# Altium project pca63100.PrjPCB (part 3 of 3)

## Sheet pca63100_mcu.SchDoc: Power Profiler Kit II
size A3; Organization: Nordic Semiconductor; DocumentNumber: 0; Revision: 1.0.1; SheetNumber: 2; SheetTotal: 6; Author: HANY; CompanyName: Nordic Semiconductor; DrawnBy: HANY; DocumentSize: A3; ProjectName: Power Profiler Kit II
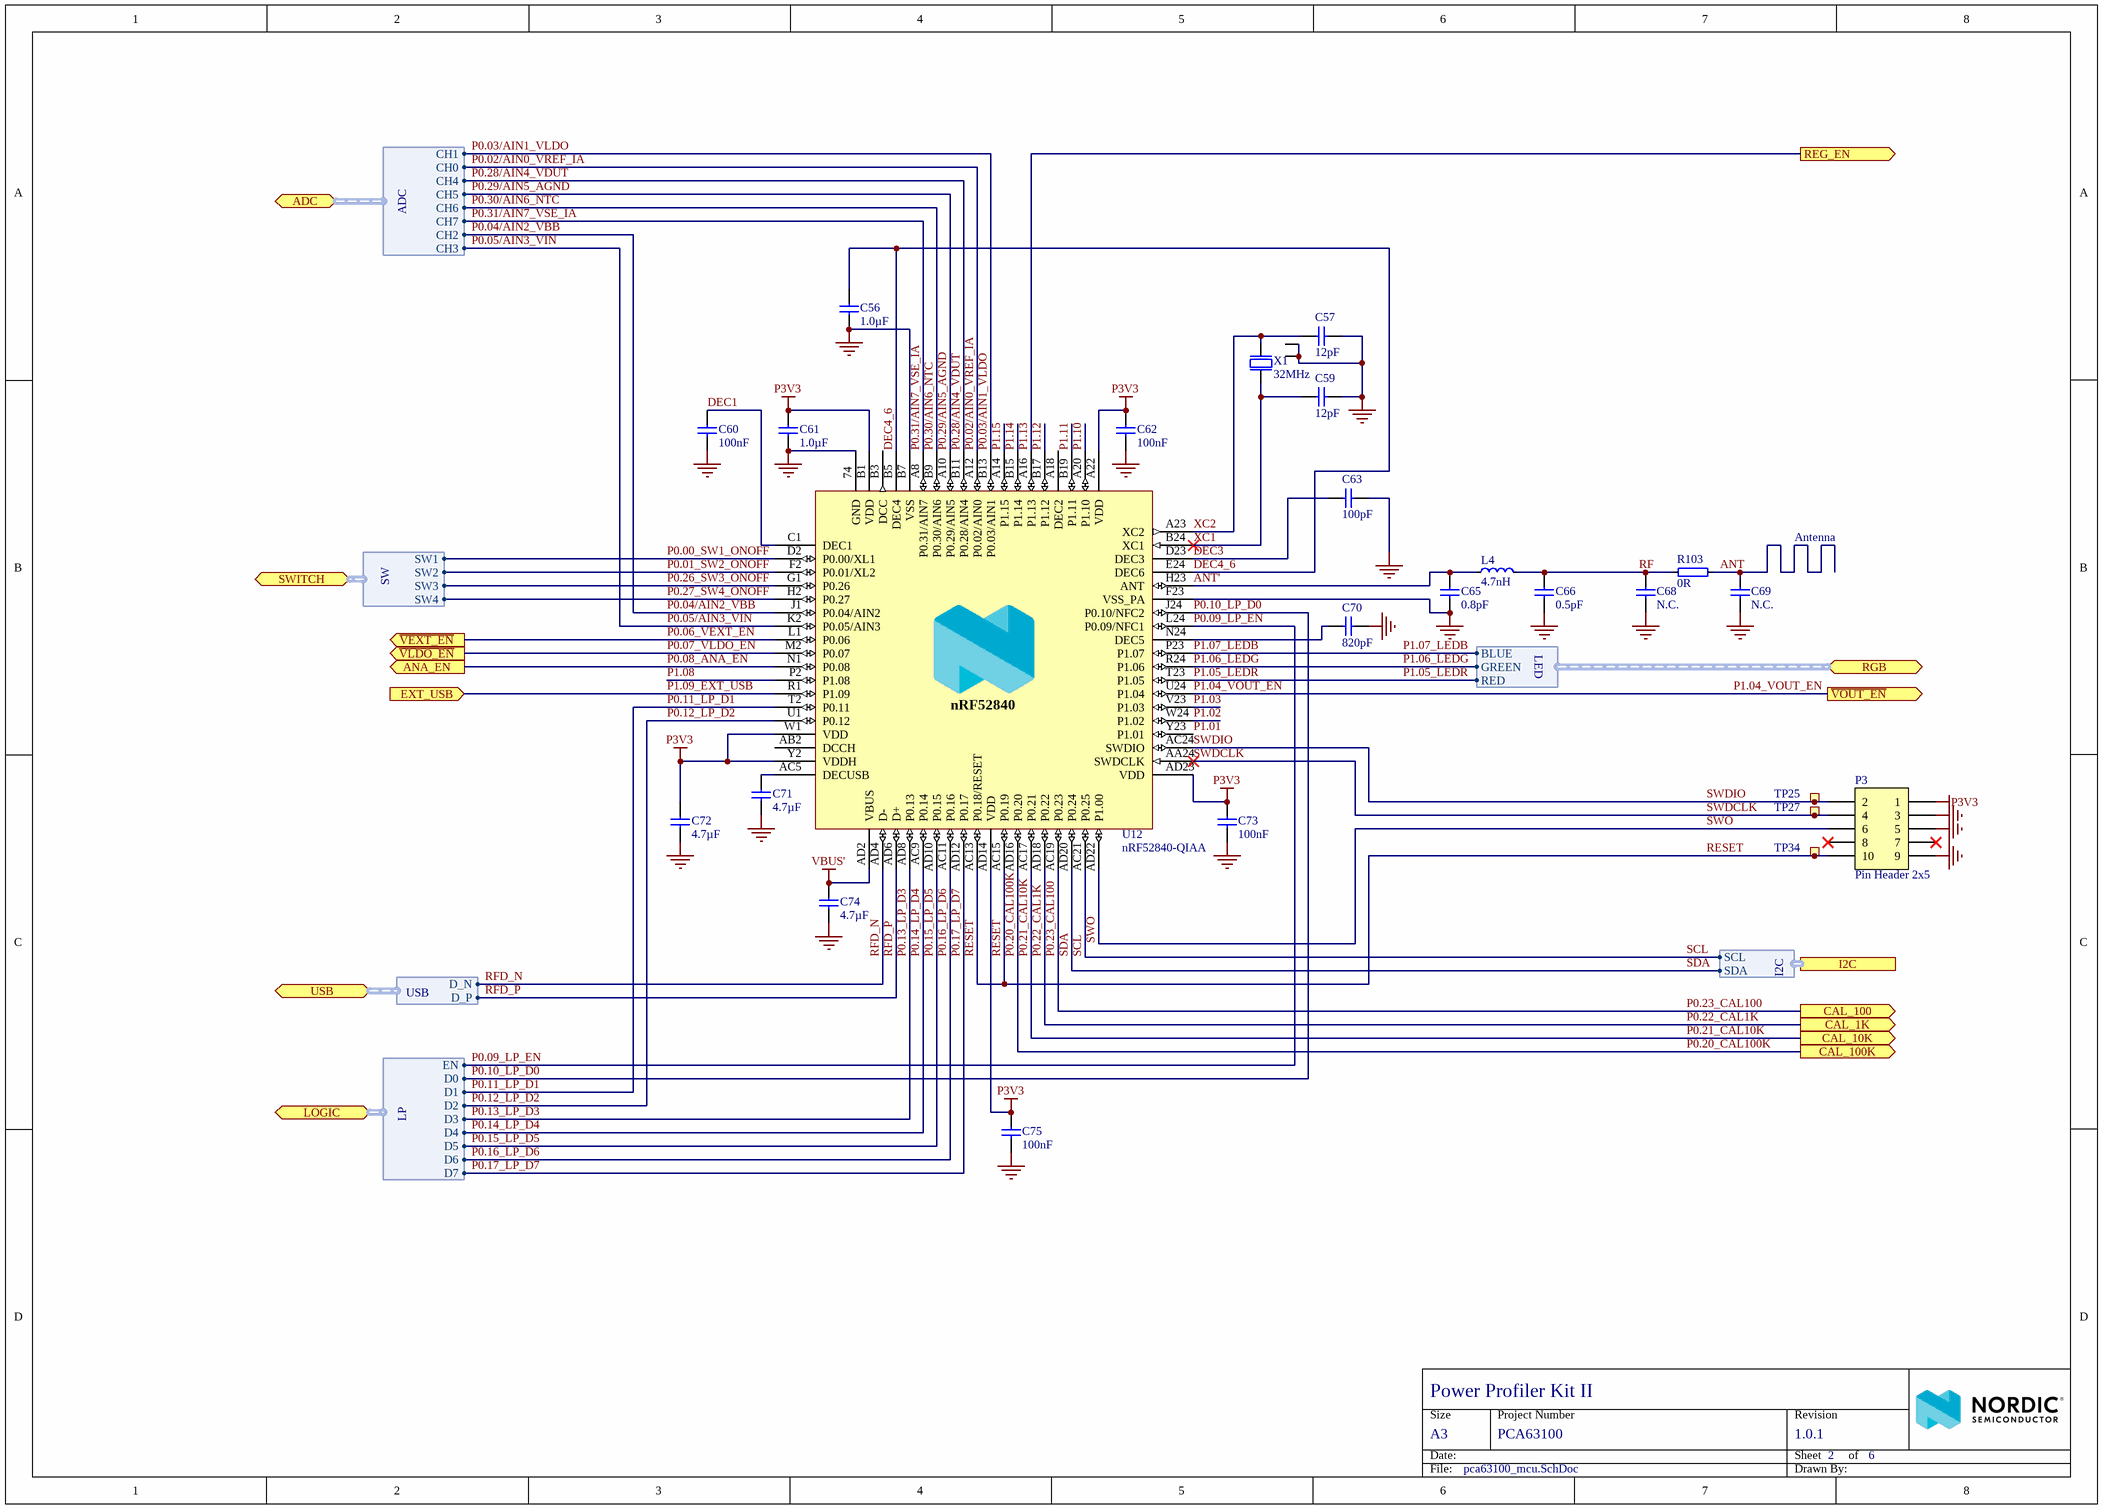
[diagram p5: pca63100_mcu.SchDoc]

### Parts
C56  1.0µF  [CAPC1005X04L]
C57  12pF  [CAPC1005X04L]
C59  12pF  [CAPC1005X04L]
C60  100nF  [CAPC0603X03L_C]
C61  1.0µF  [CAPC1005X04L]
C62  100nF  [CAPC0603X03L_C]
C63  100pF  [CAPC0603X03L_C]
C65  0.8pF  [CAPC1005X04L]
C66  0.5pF  [CAPC1005X04L]
C68  N.C.  [CAPC1005X04L_NC]
C69  N.C.  [CAPC1005X04L_NC]
C70  820pF  [CAPC1005X04L]
C71  4.7µF  [CAPC1005X04L]
C72  4.7µF  [CAPC1005X04L]
C73  100nF  [CAPC0603X03L_C]
C74  4.7µF  [CAPC1005X04L]
C75  100nF  [CAPC0603X03L_C]
L4  4.7nH  [INDC1005X04L]
P3  Pin Header 2x5  [HDR_2x5-SMD-1.27mm-ANG]
R103  0R  [RESC1005X04L]
TP25  Ø1.5mm,SMD  [TP_SMD_Ø1.5mm]  (value not drawn)  (no BOM)
TP27  Ø1.5mm,SMD  [TP_SMD_Ø1.5mm]  (value not drawn)  (no BOM)
TP34  Ø1.5mm,SMD  [TP_SMD_Ø1.5mm]  (value not drawn)  (no BOM)
U12  nRF52840-QIAA  [AQFN50P700X700X85_HS-74N]
X1  32MHz  [BT-XTAL_2016]

### Ports
ADC (bidir, harness ADC), ANA_EN (out), CAL_1K (out), CAL_10K (out), CAL_100 (out), CAL_100K (out), EXT_USB (in), I2C (harness I2C), LOGIC (bidir, harness LP), REG_EN (out), RGB (bidir, harness LED), SWITCH (bidir, harness SW), USB (bidir, harness USB), ~{VEXT_EN} (out), ~{VLDO_EN} (out), ~{VOUT_EN} (out)

### Harnesses
LP: D0, EN, D1, D2, D3, D4, D5, D6, D7
USB: D_N, D_P
LED: BLUE, GREEN, RED
SW: SW1, SW2, SW3, SW4
I2C: SCL, SDA
ADC: CH0, CH1, CH2, CH3, CH4, CH5, CH6, CH7

### Nets
GND: C56.1 C57.2 C59.2 C60.2 C61.2 C62.2 C63.2 C65.1 C66.1 C68.1 C69.1 C70.2 C71.2 C72.2 C73.2 C74.2 C75.2 P3.3 P3.5 P3.9 U12.74(GND) U12.B7(VSS) U12.F23(VSS_PA) X1.2(GND) X1.4(GND)
P3V3: C61.1 C62.1 C72.1 C73.1 C75.1 P3.1 U12.A22(VDD) U12.AD14(VDD) U12.AD23(VDD) U12.B1(VDD) U12.W1(VDD) U12.Y2(VDDH)
VBUS': C74.1 U12.AD2(VBUS)
ANT: C69.2 R103.2
ANT': C65.2 L4.1 U12.H23(ANT)
DEC1: C60.1 U12.C1(DEC1)
DEC3: C63.1 U12.D23(DEC3)
DEC4_6: C56.2 U12.B5(DEC4) U12.E24(DEC6)
P0.00_SW1_ONOFF: U12.D2(P0.00/XL1) ; port SWITCH.SW1
P0.01_SW2_ONOFF: U12.F2(P0.01/XL2) ; port SWITCH.SW2
P0.02/AIN0_VREF_IA: U12.A12(P0.02/AIN0) ; port ADC.CH0
P0.03/AIN1_VLDO: U12.B13(P0.03/AIN1) ; port ADC.CH1
P0.04/AIN2_VBB: U12.J1(P0.04/AIN2) ; port ADC.CH2
P0.05/AIN3_VIN: U12.K2(P0.05/AIN3) ; port ADC.CH3
P0.06_VEXT_EN: U12.L1(P0.06) ; port ~{VEXT_EN}
P0.07_VLDO_EN: U12.M2(P0.07) ; port ~{VLDO_EN}
P0.08_ANA_EN: U12.N1(P0.08) ; port ANA_EN
P0.09_LP_EN: U12.L24(P0.09/NFC1) ; port LOGIC.EN
P0.10_LP_D0: U12.J24(P0.10/NFC2) ; port LOGIC.D0
P0.11_LP_D1: U12.T2(P0.11) ; port LOGIC.D1
P0.12_LP_D2: U12.U1(P0.12) ; port LOGIC.D2
P0.13_LP_D3: U12.AD8(P0.13) ; port LOGIC.D3
P0.14_LP_D4: U12.AC9(P0.14) ; port LOGIC.D4
P0.15_LP_D5: U12.AD10(P0.15) ; port LOGIC.D5
P0.16_LP_D6: U12.AC11(P0.16) ; port LOGIC.D6
P0.17_LP_D7: U12.AD12(P0.17) ; port LOGIC.D7
P0.20_CAL100K: U12.AD16(P0.20) ; port CAL_100K
P0.21_CAL10K: U12.AC17(P0.21) ; port CAL_10K
P0.22_CAL1K: U12.AD18(P0.22) ; port CAL_1K
P0.23_CAL100: U12.AC19(P0.23) ; port CAL_100
P0.26_SW3_ONOFF: U12.G1(P0.26) ; port SWITCH.SW3
P0.27_SW4_ONOFF: U12.H2(P0.27) ; port SWITCH.SW4
P0.28/AIN4_VDUT: U12.B11(P0.28/AIN4) ; port ADC.CH4
P0.29/AIN5_AGND: U12.A10(P0.29/AIN5) ; port ADC.CH5
P0.30/AIN6_NTC: U12.B9(P0.30/AIN6) ; port ADC.CH6
P0.31/AIN7_VSE_IA: U12.A8(P0.31/AIN7) ; port ADC.CH7
P1.01: U12.Y23(P1.01)
P1.02: U12.W24(P1.02)
P1.03: U12.V23(P1.03)
P1.04_VOUT_EN: U12.U24(P1.04) ; port ~{VOUT_EN}
P1.05_LEDR: U12.T23(P1.05) ; port RGB.RED
P1.06_LEDG: U12.R24(P1.06) ; port RGB.GREEN
P1.07_LEDB: U12.P23(P1.07) ; port RGB.BLUE
P1.08: U12.P2(P1.08)
P1.09_EXT_USB: U12.R1(P1.09) ; port EXT_USB
P1.10: U12.A20(P1.10)
P1.11: U12.B19(P1.11)
P1.12: U12.B17(P1.12)
P1.13: U12.A16(P1.13) ; port REG_EN
P1.14: U12.B15(P1.14)
P1.15: U12.A14(P1.15)
RESET: P3.10 TP34.1 U12.AC13(P0.18/RESET) U12.AC15(P0.19)
RF: C66.2 C68.2 L4.2 R103.1
RFD_N: U12.AD4(D-) ; port USB.D_N
RFD_P: U12.AD6(D+) ; port USB.D_P
SCL: U12.AC21(P0.25) ; port I2C.SCL
SDA: U12.AD20(P0.24) ; port I2C.SDA
SWDCLK: P3.4 TP27.1 U12.AA24(SWDCLK)
SWDIO: P3.2 TP25.1 U12.AC24(SWDIO)
SWO: P3.6 U12.AD22(P1.00)
XC1: C59.1 U12.B24(XC1) X1.1(inp)
XC2: C57.1 U12.A23(XC2) X1.3(out)
NetC70_1: C70.1 U12.N24(DEC5)
NetC71_1: C71.1 U12.AC5(DECUSB)

Not connected (* = marked no-connect by the designer): P3 7* 8*; U12 A18(DEC2) AB2(DCCH) B3(DCC)

### Notes on the sheet
- Antenna
- Size
- Date:
- A3
- Project Number
- Sheet         of
- Revision
- File:
- Drawn By:
- (in symbol nRF52840-QIAAD0) nRF52840

### Library data of the parts
C56 C61 = C0402-1µ0: Capacitor, X5R, ±5%, 6.3V; Part number IPS: 00000007786, 00000003457; Artikkelnr Noca: 20039235; Pad Count: 2; Part Number: C0402-1µ0; LatestRevisionDate: 2016-08-22; Pin Count: 2; Publisher: Nordic Semiconductor; Published: 2009-05-08; Value: 1.0µF; Note: 6.3V; Footprint Doc: 0402; ComponentLink1Description: Datasheet; ComponentLink2Description: Supplier link; Supplier 1: Digi-Key; Supplier Part Number 1: 1276-1444-1-ND; Component Class: Capacitors; PartId: 100200190
C57 C59 = C0402-12p: Capacitor, NP0, ±2%; Part number IPS: 00000002398; Note: 50V; Artikkelnr Noca: 20029159; Pad Count: 2; Part Number: C0402-12p; LatestRevisionDate: 2011-05-11; Pin Count: 2; Publisher: Nordic Semiconductor; Published: 2009-05-08; Value: 12pF; Footprint Doc: 0402; ComponentLink1Description: Datasheet; ComponentLink2Description: Supplier link; Component Class: Capacitors; PartId: 100200137
C60 C62 C73 C75 = C0201-100n: Capacitor, X5R, ±10%; Part number IPS: 00000001248, 00000002505; Note: 16V; Artikkelnr Noca: N.A.; Pad Count: 2; Part Number: C0201-100n; LatestRevisionDate: 2017-11-09; Pin Count: 2; Publisher: Nordic Semiconductor; Published: 2014-11-13; Value: 100nF; Footprint Doc: 0201; ComponentLink1Description: Datasheet; ComponentLink2Description: Supplier link; Component Class: Capacitors; PartId: 100200078
C63 = C0201-100p: Capacitor, NP0, ±2%, 25V; Manufacturer: Murata; Manufacturer Part Number: GRM0335C1E101GA01; Part number IPS: 00000007853; Artikkelnr Noca: N.A.; Pad Count: 2; Part Number: C0201-100p; LatestRevisionDate: 2019-04-16; Pin Count: 2; Publisher: Nordic Semiconductor; Published: 2019-04-16; Value: 100pF; Note: 25V; Footprint Doc: 0201; ComponentLink1Description: Datasheet; ComponentLink2Description: Supplier link; Component Class: Capacitors; PartId: 100200044
C65 = C0402-0.8p: Capacitor, NP0, ±5%; Manufacturer: Murata; Manufacturer Part Number: GRM1555C1HR80WA01D; Part number IPS: 00000007782; Note: 50V; Artikkelnr Noca: 20029147; Pad Count: 2; Part Number: C0402-0.8p; LatestRevisionDate: 2012-11-21; Pin Count: 2; Publisher: Nordic Semiconductor; Published: 2009-05-08; Value: 0.8pF; Footprint Doc: 0402; ComponentLink1Description: Datasheet; ComponentLink1URL: https://www.murata.com/~/media/webrenewal/support/library/catalog/products/capacitor/mlcc/c02e.ashx?la=en-us; ComponentLink2Description: Supplier link; Supplier 1: Digi-Key; Supplier Part Number 1: 490-6270-1-ND; Component Class: Capacitors; PartId: 100200116
C66 = C0402-0.5p: Capacitor, NP0, ±0.05pF; Manufacturer: Murata; Manufacturer Part Number: GJM1555C1HR50WB01; Part number IPS: 00000004293; Note: 50V; Artikkelnr Noca: 20020007; Pad Count: 2; Part Number: C0402-0.5p; LatestRevisionDate: 2020-10-13; Pin Count: 2; Publisher: Nordic Semiconductor; Published: 2009-05-08; Value: 0.5pF; Footprint Doc: 0402; ComponentLink1Description: Datasheet; ComponentLink2Description: Supplier link; Supplier 1: Digi-Key; Supplier Part Number 1: 490-11250-1-ND; Component Class: Capacitors; PartId: 100200112
C68 C69 = C0402-N.C.: Not mounted; Note: Chip Cap; Artikkelnr Noca: N.A.; Assembly: Not mounted; Pad Count: 2; Part Number: C0402-N.C.; Footprint Doc: 0402; LatestRevisionDate: 2009-05-08; Pin Count: 2; Publisher: Nordic Semiconductor; Published: 2009-05-08; Value: N.C.; ComponentLink1Description: Datasheet; ComponentLink2Description: Supplier link; Part number IPS: N.A.; Component Class: Capacitors; PartId: 100200105
C70 = C0402-820p: Capacitor, NP0, ±5%; Part number IPS: 00000004365; Note: 50V; Artikkelnr Noca: 20029219; Pad Count: 2; Part Number: C0402-820p; LatestRevisionDate: 2020-10-13; Pin Count: 2; Publisher: Nordic Semiconductor; Published: 2009-05-08; Value: 820pF; Footprint Doc: 0402; ComponentLink1Description: Datasheet; ComponentLink2Description: Supplier link; Component Class: Capacitors; PartId: 100200161
C71 C72 C74 = C0402-4µ7: Capacitor, X5R, ±20%; Part number IPS: 00000001251, 00000007165; Note: 10V; Artikkelnr Noca: 20039482; Pad Count: 2; Part Number: C0402-4µ7; LatestRevisionDate: 2017-11-09; Pin Count: 2; Publisher: Nordic Semiconductor; Published: 2009-05-08; Value: 4.7µF; Footprint Doc: 0402; ComponentLink1Description: Datasheet; ComponentLink2Description: Supplier link; Supplier 1: Digi-Key; Supplier Part Number 1: 490-13252-1-ND; Component Class: Capacitors; PartId: 100200193
L4 = L0402-4n7: Inductor, 160mA, ±0.1nH; Manufacturer: Murata; Manufacturer Part Number: LQP15MN4N7B02D; Part number IPS: 00000004366; Note: High frequency chip inductor ±5%; Artikkelnr Noca: 33029164; Pad Count: 2; Part Number: L0402-4n7; LatestRevisionDate: 2012-09-19; Pin Count: 2; Publisher: Nordic Semiconductor; Published: 2009-05-08; Value: 4.7nH; Footprint Doc: 0402; ComponentLink1Description: Datasheet; ComponentLink2Description: Supplier link; HelpURL: http://search.murata.co.jp/Ceramy/image/img/PDF/ENG/L0075S0084LQP15M.pdf; Supplier 1: Digi-Key; Supplier Part Number 1: 490-1132-1-ND; Component Class: Inductors; PartId: 100300050
P3 = Pin Header 2x5 SMD, 1.27mm, Angled: Pin Header 2x5, 1.27mm (50mil); Manufacturer: W-CON; Manufacturer Part Number: 1325B-1205S0Z080CR02; Part number IPS: 00000007800; Artikkelnr Noca: N.A.; Pad Count: 10; Part Number: Pin Header 2x5 SMD, 1.27mm, Angled; LatestRevisionDate: 2019-11-20; Pin Count: 10; Publisher: Nordic Semiconductor; Published: 2014-01-22; Value: Pin Header 2x5; Footprint Doc: HDR_2x5-SMD-1.27mm-ANG; ComponentLink1Description: Datasheet; ComponentLink2Description: Supplier link; HelpURL: \\hizz\pro\app9717\Datasheet\connectors\W-CON\1325B-12XXXXZXXXCXXX.pdf; Supplier 1: Cabcon; Supplier Part Number 1: 1325B-1205S0Z080CR02; Supplier 2: Samtec; Supplier Part Number 2: FTSH-105-01-L-DH-A-C-TR; Component Class: Connectors; PartId: 100500257
R103 = R0402-0R: Resistor, ±5%, 0.063W; Part number IPS: 00000007128; Note: Chip Res 5%; Artikkelnr Noca: 27049000; Pad Count: 2; Part Number: R0402-0R; LatestRevisionDate: 2009-11-23; Pin Count: 2; Publisher: Nordic Semiconductor; Published: 2009-05-08; Value: 0R; Footprint Doc: 0402; ComponentLink1Description: Datasheet; ComponentLink2Description: Supplier link; Supplier 1: Farnell; Supplier Part Number 1: 146-9661; Component Class: Resistors; PartId: 100100109
TP25 TP27 TP34 = TP_SMD_Ø1.5MM: 1.5mm circular SMD testpad; Manufacturer: Nordic Semiconductor; Artikkelnr Noca: N.A.; Pad Count: 1; Part Number: TP_SMD_Ø1.5MM; ComponentLink1Description: Datasheet; ComponentLink2Description: Supplier link; Footprint Doc: TP_SMD_Ø1.5mm; LatestRevisionDate: 2016-06-02; Pin Count: 1; Publisher: Nordic Semiconductor; Published: 2016-06-02; Value: Ø1.5mm,SMD; Part number IPS: N.A.; Component Class: Connectors; PartId: 100500477
U12 = nRF52840-QIAAD0: Multi-protocol Bluetooth Low Energy, IEEE 802.15.4, ANT and 2.4GHz proprietary system-on-chip; Manufacturer: Nordic Semiconductor; Part number IPS: 80000001648; Artikkelnr Noca: N.A.; Pad Count: 73; Part Number: nRF52840-QIAAD0; LatestRevisionDate: 2018-12-04; Pin Count: 73; Publisher: Nordic Semiconductor; Published: 2018-12-04; Value: nRF52840-QIAA; Footprint Doc: AQFN-73; Manufacturer Part Number: nRF52840-QIAAD0; ComponentLink1Description: Datasheet; ComponentLink2Description: Supplier link; Supplier 1: Nordic Semiconductor; Supplier Part Number 1: nRF52840-QIAAD0; Component Class: nRF_Devices; PartId: 102000149
X1 = XTAL_SMD2016_32MHz_8pF_General: XTAL SMD 2016, 32MHz, Cl=8pF, Total Tol: ±40ppm; Part number IPS: 00000007827; Note: XTAL SMD 32.000MHz; Artikkelnr Noca: N.A.; Pad Count: 4; Part Number: XTAL_SMD2016_32MHz_8pF_General; LatestRevisionDate: 2016-08-19; Pin Count: 4; Publisher: Nordic Semiconductor; Published: 2016-08-19; Value: 32MHz; Footprint Doc: XTAL_2016; ComponentLink1Description: Datasheet; ComponentLink2Description: Supplier link; Component Class: Oscillators; PartId: 101600035

## Nets that join several sheets
GND: pca63100_top (H1.1 H2.1 H3.1 H4.1), pca63100_current_automatic_switch (SB1.2 TP26.1), pca63100_current_measurement (22 pins), pca63100_power_supply (57 pins), pca63100_misc (23 pins), pca63100_mcu (25 pins)
N2V0: pca63100_current_automatic_switch (7 pins), pca63100_power_supply (C44.2 D5.2 R79.1 TP18.1)
P3V3: pca63100_current_measurement (7 pins), pca63100_power_supply (C35.2 R68.1 TP15.1 U4.1), pca63100_misc (21 pins), pca63100_mcu (12 pins)
P7V0: pca63100_current_automatic_switch (7 pins), pca63100_power_supply (5 pins)
P8V0: pca63100_current_measurement (R37.1 R104.2 R105.2), pca63100_power_supply (7 pins)
VBUS': pca63100_power_supply (9 pins), pca63100_mcu (C74.1 U12.AD2)
VDUT+: pca63100_current_automatic_switch (R22.2 TP5.1), pca63100_current_measurement (11 pins), pca63100_power_supply (R34.2), pca63100_misc (SB3.1)
VDUT-: pca63100_current_automatic_switch (R19.2 TP2.1), pca63100_current_measurement (17 pins)
VLDO: pca63100_current_measurement (Q16.4 Q16.6), pca63100_power_supply (7 pins)
AUTO_SW1: pca63100_current_automatic_switch (R15.2 R21.2 U2.15), pca63100_current_measurement (R44.1 R45.2)
AUTO_SW2: pca63100_current_automatic_switch (R13.1 R24.2 R26.2 U2.6), pca63100_current_measurement (R48.1 R49.2)
AUTO_SW3: pca63100_current_automatic_switch (R23.1 R28.2 R30.2 U2.7), pca63100_current_measurement (R52.1 R53.2)
AUTO_SW4: pca63100_current_automatic_switch (R27.1 R32.2 U2.14), pca63100_current_measurement (R56.1 R57.2)
P0.00_SW1_ONOFF: pca63100_current_measurement (Q6.6 R43.1 TP30.1), pca63100_mcu (U12.D2)
P0.01_SW2_ONOFF: pca63100_current_measurement (Q6.3 R47.1 TP31.1), pca63100_mcu (U12.F2)
P0.02/AIN0_VREF_IA: pca63100_current_automatic_switch (C6.1 R10.1 U1.1 U1.15), pca63100_mcu (U12.A12)
P0.03/AIN1_VLDO: pca63100_power_supply (R90.1 R92.2), pca63100_mcu (U12.B13)
P0.04/AIN2_VBB: pca63100_power_supply (R16.1 R91.2), pca63100_mcu (U12.J1)
P0.05/AIN3_VIN: pca63100_power_supply (R110.1 R111.2), pca63100_mcu (U12.K2)
P0.06_VEXT_EN: pca63100_current_measurement (Q17.2 R106.1 TP40.1), pca63100_mcu (U12.L1)
P0.07_VLDO_EN: pca63100_current_measurement (Q17.5 R107.1 TP41.1), pca63100_mcu (U12.M2)
P0.08_ANA_EN: pca63100_power_supply (R68.2 U5.C1), pca63100_mcu (U12.N1)
P0.09_LP_EN: pca63100_misc (R102.1 U11.11), pca63100_mcu (U12.L24)
P0.10_LP_D0: pca63100_misc (U11.9), pca63100_mcu (U12.J24)
P0.11_LP_D1: pca63100_misc (U11.8), pca63100_mcu (U12.T2)
P0.12_LP_D2: pca63100_misc (U11.7), pca63100_mcu (U12.U1)
P0.13_LP_D3: pca63100_misc (U11.6), pca63100_mcu (U12.AD8)
P0.14_LP_D4: pca63100_misc (U11.5), pca63100_mcu (U12.AC9)
P0.15_LP_D5: pca63100_misc (U11.4), pca63100_mcu (U12.AD10)
P0.16_LP_D6: pca63100_misc (U11.3), pca63100_mcu (U12.AC11)
P0.17_LP_D7: pca63100_misc (U11.2), pca63100_mcu (U12.AD12)
P0.20_CAL100K: pca63100_current_measurement (Q4.2 R59.2), pca63100_mcu (U12.AD16)
P0.21_CAL10K: pca63100_current_measurement (Q4.5 R35.2), pca63100_mcu (U12.AC17)
P0.22_CAL1K: pca63100_current_measurement (Q11.2 R109.2), pca63100_mcu (U12.AD18)
P0.23_CAL100: pca63100_current_measurement (Q11.5 R108.2), pca63100_mcu (U12.AC19)
P0.26_SW3_ONOFF: pca63100_current_measurement (Q8.6 R51.1 TP32.1), pca63100_mcu (U12.G1)
P0.27_SW4_ONOFF: pca63100_current_measurement (Q8.3 R55.1 TP33.1), pca63100_mcu (U12.H2)
P0.28/AIN4_VDUT: pca63100_power_supply (R34.1 R36.2), pca63100_mcu (U12.B11)
P0.29/AIN5_AGND: pca63100_current_automatic_switch (SB2.1 TP10.1), pca63100_mcu (U12.A10)
P0.30/AIN6_NTC: pca63100_misc (R72.1 R113.2), pca63100_mcu (U12.B9)
P0.31/AIN7_VSE_IA: pca63100_current_automatic_switch (C8.2 R8.2 R9.2 TP1.1), pca63100_mcu (U12.A8)
P1.04_VOUT_EN: pca63100_current_measurement (Q1.2 R39.1), pca63100_mcu (U12.U24)
P1.05_LEDR: pca63100_misc (Q15.5 R99.2), pca63100_mcu (U12.T23)
P1.06_LEDG: pca63100_misc (Q15.2 R100.2), pca63100_mcu (U12.R24)
P1.07_LEDB: pca63100_misc (Q1.5 R101.2), pca63100_mcu (U12.P23)
P1.09_EXT_USB: pca63100_power_supply (R17.2 R18.2), pca63100_mcu (U12.R1)
P1.13: pca63100_power_supply (U8.6 U9.1), pca63100_mcu (U12.A16)
POT0: pca63100_power_supply (R112.2), pca63100_misc (TP24.1 U10.10)
POT1: pca63100_power_supply (R14.2), pca63100_misc (TP23.1 U10.7)
POT3: pca63100_current_automatic_switch (U1.2), pca63100_misc (TP21.1 U10.20)
RFD_N: pca63100_power_supply (D3.3 J2.2 TP13.1), pca63100_mcu (U12.AD4)
RFD_P: pca63100_power_supply (D3.2 J2.3 TP14.1), pca63100_mcu (U12.AD6)
SCL: pca63100_misc (R82.1 U7.1 U10.3), pca63100_mcu (U12.AC21)
SDA: pca63100_misc (R81.1 U7.3 U10.4), pca63100_mcu (U12.AD20)

## Assembly variants
Default Assembly: not fitted A1 C1 C4 C6 C29 C33 C58 C64 C65 C66 C68 C69 L4 L5 LD5 LD6 P3 P3 R63 R70 R103 R115 R117 R118 R119